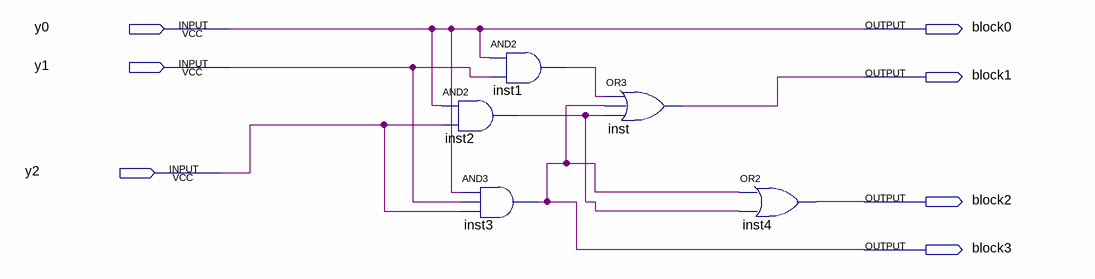
[diagram p0: schematic sheet]
// Quartus schematic switch7.bdf as structural Verilog: 5 symbols, 7 pins
module switch7 (
  input  y0,
  input  y1,
  input  y2,
  output block0,
  output block1,
  output block2,
  output block3
);

  wire inst1_out, inst2_out;

  and inst2 (inst2_out, y0, y2);
  and inst3 (block3, y0, y1, y2);
  and inst1 (inst1_out, y0, y1);
  or inst (block1, inst1_out, block3, inst2_out);
  or inst4 (block2, block3, inst2_out);

  assign block0 = y0;
endmodule
